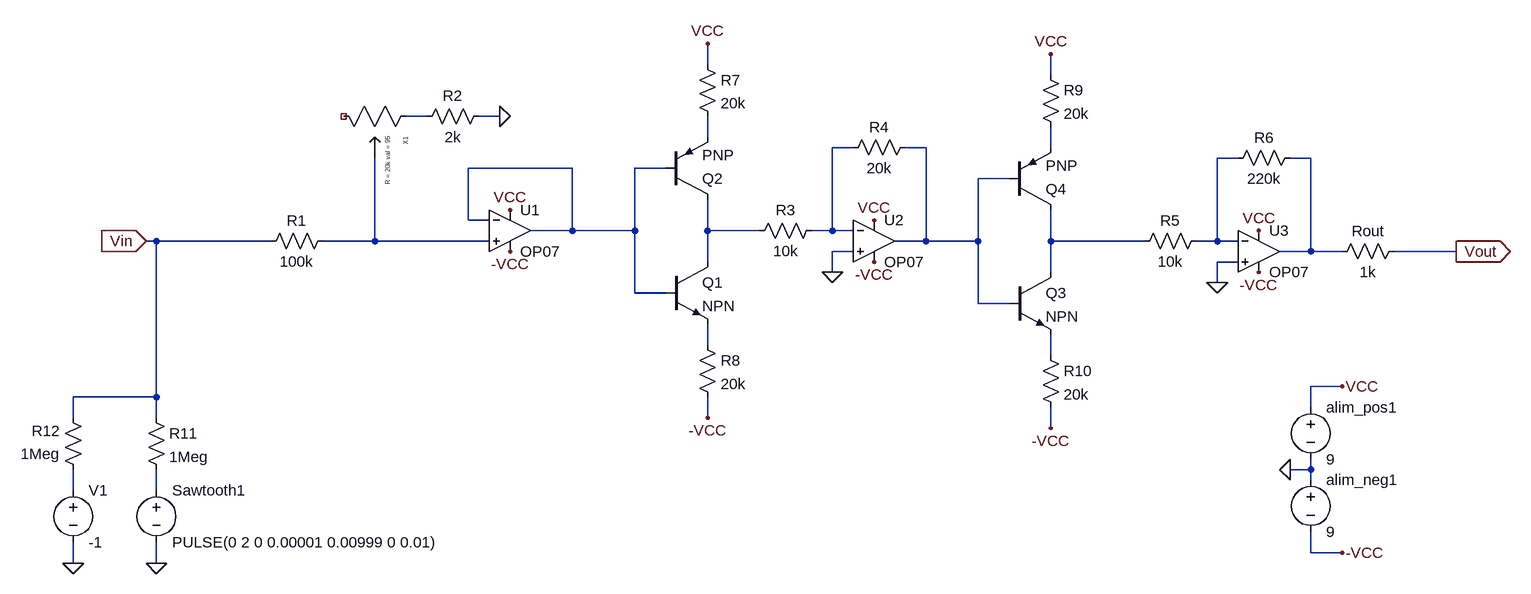
[diagram p0: schematic Draft2.asc]
Draft2.asc, the LTspice schematic file:
Version 4.1
SHEET 1 1168 680
WIRE -144 -160 -144 -192
WIRE 384 -144 384 -176
WIRE -576 -80 -608 -80
WIRE -464 -80 -496 -80
WIRE -144 -48 -144 -80
WIRE 80 -32 48 -32
WIRE 192 -32 160 -32
WIRE 384 -32 384 -64
WIRE 672 -16 640 -16
WIRE 784 -16 752 -16
WIRE -352 0 -512 0
WIRE -208 0 -256 0
WIRE 320 16 272 16
WIRE -512 80 -512 0
WIRE -480 80 -512 80
WIRE -352 96 -352 0
WIRE -352 96 -416 96
WIRE -256 96 -256 0
WIRE -256 96 -352 96
WIRE -144 96 -144 48
WIRE -64 96 -144 96
WIRE 48 96 48 -32
WIRE 48 96 16 96
WIRE 80 96 48 96
WIRE -992 112 -1008 112
WIRE -816 112 -992 112
WIRE -656 112 -656 -16
WIRE -656 112 -736 112
WIRE -480 112 -656 112
WIRE 192 112 192 -32
WIRE 192 112 144 112
WIRE 272 112 272 16
WIRE 272 112 192 112
WIRE 384 112 384 64
WIRE 528 112 384 112
WIRE 640 112 640 -16
WIRE 640 112 608 112
WIRE 672 112 640 112
WIRE 80 128 48 128
WIRE 784 128 784 -16
WIRE 784 128 736 128
WIRE 832 128 784 128
WIRE 1008 128 912 128
WIRE -144 144 -144 96
WIRE 672 144 640 144
WIRE 48 160 48 128
WIRE 384 160 384 112
WIRE 640 176 640 144
WIRE -256 192 -256 96
WIRE -208 192 -256 192
WIRE 272 208 272 112
WIRE 320 208 272 208
WIRE -144 272 -144 240
WIRE 384 288 384 256
WIRE 832 336 784 336
WIRE -992 352 -992 112
WIRE -992 352 -1120 352
WIRE 784 368 784 336
WIRE -1120 384 -1120 352
WIRE -992 384 -992 352
WIRE -144 384 -144 352
WIRE 384 400 384 368
WIRE 784 464 784 448
WIRE 784 464 752 464
WIRE 784 480 784 464
WIRE -1120 496 -1120 464
WIRE -992 496 -992 464
WIRE 784 592 784 560
WIRE 832 592 784 592
WIRE -1120 608 -1120 576
WIRE -992 608 -992 576
FLAG -1008 112 Vin
IOPIN -1008 112 In
FLAG 752 464 0
FLAG 1008 128 Vout
IOPIN 1008 128 Out
FLAG 832 336 VCC
FLAG 832 592 -VCC
FLAG -448 64 VCC
FLAG 112 80 VCC
FLAG 112 144 -VCC
FLAG -992 608 0
FLAG -1120 608 0
FLAG -448 128 -VCC
FLAG 48 160 0
FLAG 704 96 VCC
FLAG 704 160 -VCC
FLAG 640 176 0
FLAG -144 384 -VCC
FLAG -144 -192 VCC
FLAG 384 400 -VCC
FLAG 384 -176 VCC
FLAG -464 -80 0
SYMBOL res -592 -64 R270
WINDOW 0 32 56 VTop 2
WINDOW 3 0 56 VBottom 2
SYMATTR InstName R2
SYMATTR Value 2k
SYMBOL res -80 112 R270
WINDOW 0 32 56 VTop 2
WINDOW 3 0 56 VBottom 2
SYMATTR InstName R3
SYMATTR Value 10k
SYMBOL res 176 -48 R90
WINDOW 0 0 56 VBottom 2
WINDOW 3 32 56 VTop 2
SYMATTR InstName R4
SYMATTR Value 20k
SYMBOL res 624 96 R90
WINDOW 0 0 56 VBottom 2
WINDOW 3 32 56 VTop 2
SYMATTR InstName R5
SYMATTR Value 10k
SYMBOL OpAmps\\OP07 -448 32 R0
SYMATTR InstName U1
SYMBOL voltage 784 352 R0
SYMATTR InstName alim_pos1
SYMATTR Value 9
SYMBOL voltage 784 464 R0
SYMATTR InstName alim_neg1
SYMATTR Value 9
SYMBOL OpAmps\\OP07 112 48 R0
SYMATTR InstName U2
SYMBOL voltage -992 480 R0
WINDOW 123 0 0 Left 0
WINDOW 39 0 0 Left 0
SYMATTR InstName Sawtooth1
SYMATTR Value PULSE(0 2 0 0.00001 0.00999 0 0.01)
SYMBOL res -1008 368 R0
SYMATTR InstName R11
SYMATTR Value 1Meg
SYMBOL res -1104 480 R180
WINDOW 0 36 76 Left 2
WINDOW 3 36 40 Left 2
SYMATTR InstName R12
SYMATTR Value 1Meg
SYMBOL voltage -1120 480 R0
SYMATTR InstName V1
SYMATTR Value -1
SYMBOL res 928 112 R90
WINDOW 0 0 56 VBottom 2
WINDOW 3 32 56 VTop 2
SYMATTR InstName Rout
SYMATTR Value 1k
SYMBOL res -720 96 R90
WINDOW 0 0 56 VBottom 2
WINDOW 3 32 56 VTop 2
SYMATTR InstName R1
SYMATTR Value 100k
SYMBOL res 768 -32 R90
WINDOW 0 0 56 VBottom 2
WINDOW 3 32 56 VTop 2
SYMATTR InstName R6
SYMATTR Value 220k
SYMBOL OpAmps\\OP07 704 64 R0
SYMATTR InstName U3
SYMBOL pot -624 -112 R90
WINDOW 39 64 12 Left 0
SYMATTR InstName X1
SYMATTR SpiceLine R = 20k val = 95
SYMBOL npn -208 144 R0
SYMATTR InstName Q1
SYMBOL pnp -208 48 M180
SYMATTR InstName Q2
SYMBOL res -160 -176 R0
SYMATTR InstName R7
SYMATTR Value 20k
SYMBOL res -160 256 R0
SYMATTR InstName R8
SYMATTR Value 20k
SYMBOL npn 320 160 R0
SYMATTR InstName Q3
SYMBOL pnp 320 64 M180
SYMATTR InstName Q4
SYMBOL res 368 -160 R0
SYMATTR InstName R9
SYMATTR Value 20k
SYMBOL res 368 272 R0
SYMATTR InstName R10
SYMATTR Value 20k

The netlist it stands for:
* Draft2.asc
R2 N001 0 2k
R3 N009 N003 10k
R4 N004 N003 20k
R5 N006 N011 10k
X§U1 N010 N008 VCC -VCC N008 LT1001  ; OP07, pins In+ In- V+ V- OUT
V§alim_pos1 VCC 0 9
V§alim_neg1 0 -VCC 9
X§U2 0 N003 VCC -VCC N004 LT1001  ; OP07, pins In+ In- V+ V- OUT
V§Sawtooth1 N015 0 PULSE(0 2 0 0.00001 0.00999 0 0.01)
R11 Vin N015 1Meg
R12 N014 Vin 1Meg
V1 N014 0 -1
Rout Vout N007 1k
R1 N010 Vin 100k
R6 N007 N006 220k
X§U3 0 N006 VCC -VCC N007 LT1001  ; OP07, pins In+ In- V+ V- OUT
X§X1 N001 N010 NC_01 pot R = 20k val = 95  ; pins 1 2 3
Q1 N009 N008 N012 0 NPN
Q2 N009 N008 N002 0 PNP
R7 VCC N002 20k
R8 N012 -VCC 20k
Q3 N011 N004 N013 0 NPN
Q4 N011 N004 N005 0 PNP
R9 VCC N005 20k
R10 N013 -VCC 20k
.model NPN NPN
.model PNP PNP
.lib standard.bjt
.lib LTC.lib
.backanno
.end